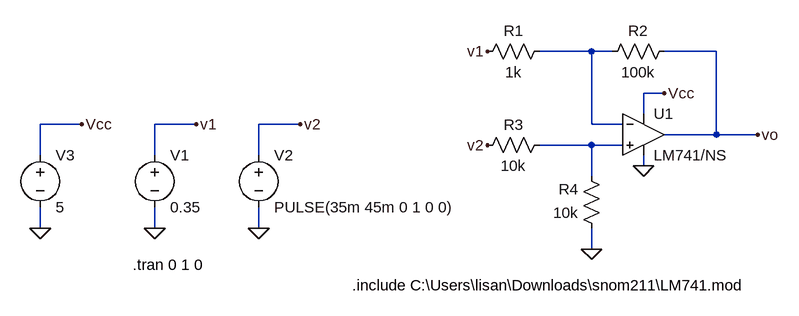
[diagram p0: schematic Draft1.asc]
Draft1.asc, the LTspice schematic file:
Version 4
SHEET 1 880 680
WIRE 160 -16 80 -16
WIRE 192 -16 160 -16
WIRE 352 -16 272 -16
WIRE 272 48 240 48
WIRE 240 80 240 48
WIRE -624 96 -688 96
WIRE -448 96 -512 96
WIRE -288 96 -352 96
WIRE 160 96 160 -16
WIRE 208 96 160 96
WIRE 352 112 352 -16
WIRE 352 112 272 112
WIRE 416 112 352 112
WIRE 160 128 80 128
WIRE 208 128 160 128
WIRE -688 144 -688 96
WIRE -512 144 -512 96
WIRE -352 144 -352 96
WIRE 240 160 240 144
WIRE 160 176 160 128
WIRE -688 256 -688 224
WIRE -512 256 -512 224
WIRE -352 256 -352 224
WIRE 160 288 160 256
FLAG 0 -16 v1
FLAG 0 128 v2
FLAG 160 288 0
FLAG -512 256 0
FLAG -448 96 v1
FLAG -352 256 0
FLAG -288 96 v2
FLAG 416 112 vo
FLAG -688 256 0
FLAG -624 96 Vcc
FLAG 272 48 Vcc
FLAG 240 160 0
SYMBOL res 96 -32 R90
WINDOW 0 0 56 VBottom 2
WINDOW 3 32 56 VTop 2
SYMATTR InstName R1
SYMATTR Value 1k
SYMBOL res 96 112 R90
WINDOW 0 0 56 VBottom 2
WINDOW 3 32 56 VTop 2
SYMATTR InstName R3
SYMATTR Value 10k
SYMBOL res 288 -32 R90
WINDOW 0 0 56 VBottom 2
WINDOW 3 32 56 VTop 2
SYMATTR InstName R2
SYMATTR Value 100k
SYMBOL res 176 272 R180
WINDOW 0 36 76 Left 2
WINDOW 3 36 40 Left 2
SYMATTR InstName R4
SYMATTR Value 10k
SYMBOL Opamps\\opamp2 240 48 R0
SYMATTR InstName U1
SYMATTR Value LM741/NS
SYMBOL voltage -512 128 R0
WINDOW 123 0 0 Left 0
WINDOW 39 0 0 Left 0
SYMATTR InstName V1
SYMATTR Value 0.35
SYMBOL voltage -352 128 R0
WINDOW 123 0 0 Left 0
WINDOW 39 0 0 Left 0
SYMATTR InstName V2
SYMATTR Value PULSE(35m 45m 0 1 0 0)
SYMBOL voltage -688 128 R0
WINDOW 123 0 0 Left 0
WINDOW 39 0 0 Left 0
SYMATTR InstName V3
SYMATTR Value 5
TEXT -546 312 Left 2 !.tran 0 1 0
TEXT -208 344 Left 2 !.include C:\\Users\\lisan\\Downloads\\snom211\\LM741.mod

The netlist it stands for:
* Draft1.asc
R1 N001 v1 1k
R3 N002 v2 10k
R2 vo N001 100k
R4 0 N002 10k
XU1 N002 N001 Vcc 0 vo LM741/NS  ; pins In+ In- V+ V- OUT
V1 v1 0 0.35
V2 v2 0 PULSE(35m 45m 0 1 0 0)
V3 Vcc 0 5
.tran 0 1 0
.include C:\Users\lisan\Downloads\snom211\LM741.mod
.backanno
.end